# Altium schematic sheet sensors.SchDoc
size A4
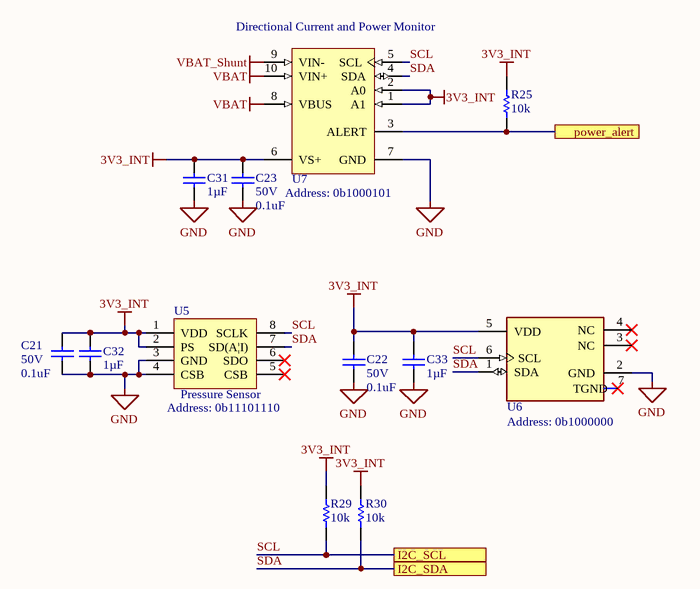
[diagram p0: sensors.SchDoc]

## Parts
C21  Voltage: 50V  Capacitance: 0.1uF  [FP-CL10-0_1-MFG]  (hidden comment: CL10B104JB8NNNC)
C22  Voltage: 50V  Capacitance: 0.1uF  [FP-CL10-0_1-MFG]  (hidden comment: CL10B104JB8NNNC)
C23  Voltage: 50V  Capacitance: 0.1uF  [FP-CL10-0_1-MFG]  (hidden comment: CL10B104JB8NNNC)
C31  value 1µF  [CAPC1608N(0603")]  (hidden comment: 1uF 50V 0603 SMD, Ceramic)
C32  value 1µF  [CAPC1608N(0603")]  (hidden comment: 1uF 50V 0603 SMD, Ceramic)
C33  value 1µF  [CAPC1608N(0603")]  (hidden comment: 1uF 50V 0603 SMD, Ceramic)
R25  value 10k  [RESC1608N(0603")]  (hidden comment: 10kR, 1%, 1/10W, 0603 SMD)
R29  value 10k  [RESC1608N(0603")]  (hidden comment: 10kR, 1%, 1/10W, 0603 SMD)
R30  value 10k  [RESC1608N(0603")]  (hidden comment: 10kR, 1%, 1/10W, 0603 SMD)
U5  Pressure Sensor  [TE Pressure Sensor (MS560702BA03-50)]
U6  Si700XX  [FP-SI7021-A20-GM1R-IPC_B]  (value not drawn)
U7  Directional Current and Power Monitor  [DGS0010A_L]

## Ports
I2C_SCL, I2C_SDA, power_alert

## Nets
3V3_INT: C21.2 C22.2 C23.2 C31.2(Cathode) C32.2(Cathode) C33.2(Cathode) R25.2 R29.2 R30.2 U5.1(VDD) U5.2(PS) U6.5(VDD) U7.1(A1) U7.2(A0) U7.6(VS+)
GND: C21.1 C22.1 C23.1 C31.1(Anode) C32.1(Anode) C33.1(Anode) U5.3(GND) U5.4(CSB) U6.2(GND) U7.7(GND)
VBAT: U7.8(VBUS) U7.10(VIN+)
VBAT_Shunt: U7.9(VIN-)
power_alert: R25.1 U7.3(ALERT) ; port power_alert
SCL: R29.1 U5.8(SCLK) U6.6(SCL) U7.5(SCL) ; port I2C_SCL
SDA: R30.1 U5.7(SD(A|I)) U6.1(SDA) U7.4(SDA) ; port I2C_SDA

Not connected (* = marked no-connect by the designer): U5 5(CSB)* 6(SDO)*; U6 3(NC)* 4(NC)* 7(TGND)*

## Notes on the sheet
- Address: 0b1000101
- (near U5) Address: 0b11101110
- (near U6) Address: 0b1000000

## Library data of the parts
C21-C23 = CMP-00000-3: CAP CER 0.1UF 50V X7R 0603; Tolerance: 5%; Material: Ceramic; Case Code (Imperial): 0603; Mount: Surface Mount; Thickness: 0.035inch; Depth: 0.8mm; Packaging: Tape and Reel; Package Quantity: 1; Dielectric: X7R; Height: 0.8mm; Radiation Hardening: No; Max Operating Temperature: 125°C; Voltage Rating: 50V; Case/Package: 0603; Min Operating Temperature: -55°C; Case Code (Metric): 1608; Length: 1.6mm; Contact Plating: Tin; Width: 0.031inch
C31-C33 = CMP-006-0028-1: Capacitor, Ceramic, 50V, +/- 10%, 0603 SMD, X5R; Design Item ID: 1uF 50V 0603 SMD, Ceramic; Created By: Lyden Smith; PackageDescription: Chip Capacitor; Source: AUVic_Schematic_Library_Capacitors.SchLib; Date Created: 2017-10-26; Pin Count: 2; Component Type: Standard
R25 R29 R30 = CMP-047-0013-1: Owned By: AUVic; Made By: Ashwin Sira; Design Item ID: 10kR, 1%, 1/10W, 0603 SMD; Pin Count: 2; Component Type: Standard; Created On: 14-05-31; Last Edited: 14-05-31; Source: AUVic_Schematic_Library_Resistors.SchLib
U5 = CMP-048-0005-2: 1kPa to 120 kPa; Made by: Andy Bates; Created on: 2017-09-11; Source: AUVic_Schematic_Library_Sensors.SchLib; Component Type: Standard; Design Item ID: MS560702BA03-50 Pressure Sensor; Pin Count: 8
U6 = CMP-048-0009-2: I2C Humidity and Temperature Sensor; Made by: Andy Bates; Pin Count: 4; Design Item ID: Si700XX; Source: AUVic_Schematic_Library_Sensors.SchLib; Component Type: Standard; Created on: 2019/09/08
U7 = CMP-00032-1: Bi Directional Current and Power Monitor 10-Pin VSSOP T/R; Nominal Supply Current: 330uA; Common Mode Rejection Ratio: 140dB; Output Current: 10mA; Accuracy: 0.02%; Input Bias Current: 10uA; Input Offset Voltage (Vos): 2.5uV; Min Supply Voltage: 2.7V; Max Supply Voltage: 5.5V; Mount: Surface Mount; Case/Package: VSSOP; Contact Plating: Gold; Radiation Hardening: No; Packaging: Tape and Reel; Package Quantity: 1; Max Operating Temperature: 125°C; Lead Free: Lead Free; Number of Pins: 10; Min Operating Temperature: -40°C; REACH SVHC: No SVHC